# Altium project hand_logic.PrjPcb (part 2 of 3)

## Sheet USB_HUB.SchDoc
size Letter; SheetNumber: 10; SheetTotal: 15
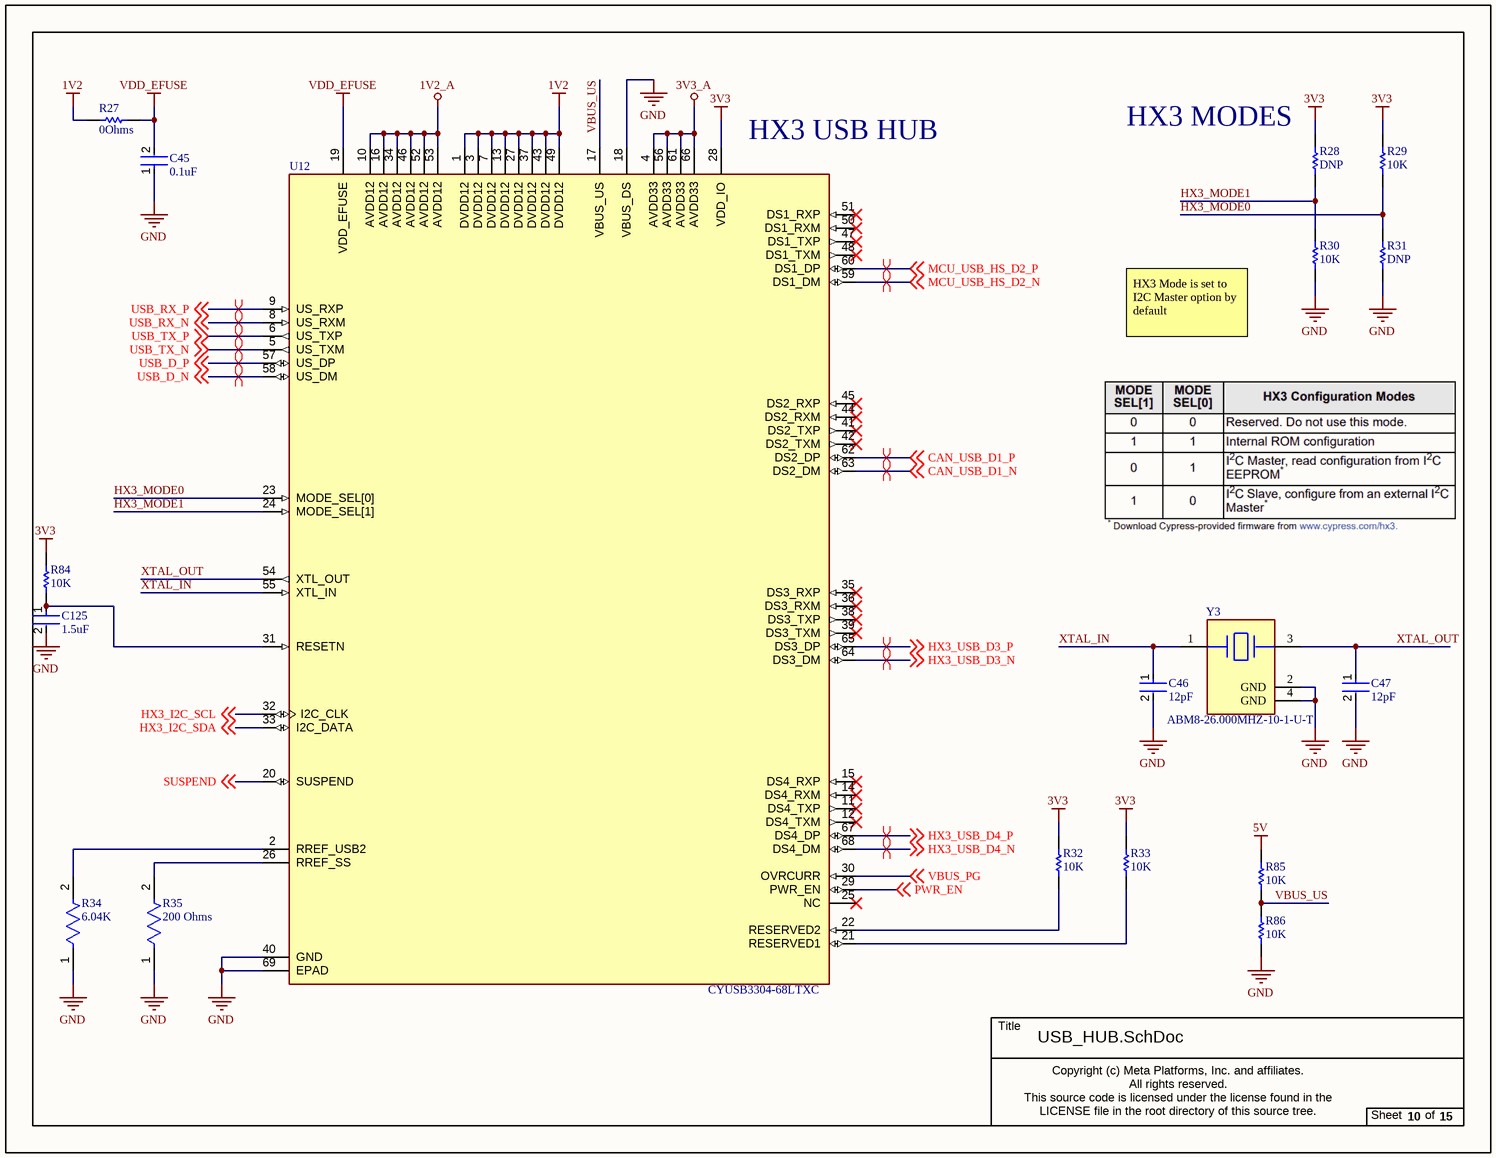
[diagram p9: USB_HUB.SchDoc]

### Parts
C45  0.1uF  [FP-CC0201-BA-MFG]
C46  12pF  [FP-0402-L_1_0_1-W_0_5_0_1-IPC_B]
C47  12pF  [FP-0402-L_1_0_1-W_0_5_0_1-IPC_B]
C125  1.5uF  [FP-C1005-050-0_05-IPC_A]
R27  0Ohms  [RESC1005X40X25ML05T10]
R28  DNP  [RESC1005X40X25ML05T10]
R29  10K  [RESC1005X40X25ML05T10]
R30  10K  [RESC1005X40X25ML05T10]
R31  DNP  [RESC1005X40X25ML05T10]
R32  10K  [RESC1005X40X25ML05T10]
R33  10K  [RESC1005X40X25ML05T10]
R34  6.04K  [FP-RMCF0402-IPC_A]
R35  200 Ohms  [FP-RMCF0402-IPC_B]
R84  10K  [RESC1005X40X25ML05T10]
R85  10K  [RESC1005X40X25ML05T10]
R86  10K  [RESC1005X40X25ML05T10]
U12  CYUSB3304-68LTXC  [QFN40P800X800X100-69M]
Y3  ABM8-26.000MHZ-10-1-U-T  [FP-ABM8-MFG]

### Nets
1V2: R27.2 U12.1(DVDD12) U12.3(DVDD12) U12.7(DVDD12) U12.13(DVDD12) U12.27(DVDD12) U12.37(DVDD12) U12.43(DVDD12) U12.49(DVDD12)
1V2_A: U12.10(AVDD12) U12.16(AVDD12) U12.34(AVDD12) U12.46(AVDD12) U12.52(AVDD12) U12.53(AVDD12)
3V3: R28.2 R29.2 R32.2 R33.2 R84.2 U12.28(VDD_IO)
3V3_A: U12.4(AVDD33) U12.56(AVDD33) U12.61(AVDD33) U12.66(AVDD33)
5V: R85.2
GND: C45.1 C46.2 C47.2 C125.2 R30.1 R31.1 R34.1 R35.1 R86.1 U12.18(VBUS_DS) U12.40(GND) U12.69(EPAD) Y3.2(GND) Y3.4(GND)
VDD_EFUSE: C45.2 R27.1 U12.19(VDD_EFUSE)
CAN_USB_D1_N: U12.63(DS2_DM) ; off-sheet CAN_USB_D1_N
CAN_USB_D1_P: U12.62(DS2_DP) ; off-sheet CAN_USB_D1_P
HX3_I2C_SCL: U12.32(I2C_CLK) ; off-sheet HX3_I2C_SCL
HX3_I2C_SDA: U12.33(I2C_DATA) ; off-sheet HX3_I2C_SDA
HX3_MODE0: R29.1 R31.2 U12.23(MODE_SEL[0])
HX3_MODE1: R28.1 R30.2 U12.24(MODE_SEL[1])
HX3_USB_D3_N: U12.64(DS3_DM) ; off-sheet HX3_USB_D3_N
HX3_USB_D3_P: U12.65(DS3_DP) ; off-sheet HX3_USB_D3_P
HX3_USB_D4_N: U12.68(DS4_DM) ; off-sheet HX3_USB_D4_N
HX3_USB_D4_P: U12.67(DS4_DP) ; off-sheet HX3_USB_D4_P
MCU_USB_HS_D2_N: U12.59(DS1_DM) ; off-sheet MCU_USB_HS_D2_N
MCU_USB_HS_D2_P: U12.60(DS1_DP) ; off-sheet MCU_USB_HS_D2_P
PWR_EN: U12.29(PWR_EN) ; off-sheet PWR_EN
SUSPEND: U12.20(SUSPEND) ; off-sheet SUSPEND
USB_D_N: U12.58(US_DM) ; off-sheet USB_D_N
USB_D_P: U12.57(US_DP) ; off-sheet USB_D_P
USB_RX_N: U12.8(US_RXM) ; off-sheet USB_RX_N
USB_RX_P: U12.9(US_RXP) ; off-sheet USB_RX_P
USB_TX_N: U12.5(US_TXM) ; off-sheet USB_TX_N
USB_TX_P: U12.6(US_TXP) ; off-sheet USB_TX_P
VBUS_PG: U12.30(OVRCURR) ; off-sheet VBUS_PG
VBUS_US: R85.1 R86.2 U12.17(VBUS_US)
XTAL_IN: C46.1 U12.55(XTL_IN) Y3.1
XTAL_OUT: C47.1 U12.54(XTL_OUT) Y3.3
NetC125_1: C125.1 R84.1 U12.31(RESETN)
NetR32_1: R32.1 U12.22(RESERVED2)
NetR33_1: R33.1 U12.21(RESERVED1)
NetR34_2: R34.2 U12.2(RREF_USB2)
NetR35_2: R35.2 U12.26(RREF_SS)

Not connected (* = marked no-connect by the designer): U12 11(DS4_TXP)* 12(DS4_TXM)* 14(DS4_RXM)* 15(DS4_RXP)* 25(NC)* 35(DS3_RXP)* 36(DS3_RXM)* 38(DS3_TXP)* 39(DS3_TXM)* 41(DS2_TXP)* 42(DS2_TXM)* 44(DS2_RXM)* 45(DS2_RXP)* 47(DS1_TXP)* 48(DS1_TXM)* 50(DS1_RXM)* 51(DS1_RXP)*

### Layout directives
differential pair; differential pair class USB_3: USB_RX_N, USB_RX_P, USB_TX_N, USB_TX_P
differential pair; differential pair class USB_2: CAN_USB_D1_N, CAN_USB_D1_P, HX3_USB_D3_N, HX3_USB_D3_P, HX3_USB_D4_N, HX3_USB_D4_P, MCU_USB_HS_D2_N, MCU_USB_HS_D2_P, USB_D_N, USB_D_P

### Notes on the sheet
- (near U12) HX3 USB HUB
- HX3 MODES
- HX3 Mode is set to
  I2C Master option by
  default
- Title
- Copyright (c) Meta Platforms, Inc. and affiliates.
  All rights reserved.
  This source code is licensed under the license found in the
  LICENSE file in the root directory of this source tree.
- Sheet
- of

### Library data of the parts
C45 = CMP-03422-000376-1: CAP CER 0.1UF 6.3V X5R 0201; Manufacturer: Yageo; Manufacturer Part Number: CC0201KRX5R5BB104; Tolerance: 0.1; Temperature Coefficient: 15%; Value: 100 nF; Material: Ceramic; Automotive: No; Device Class L2: Capacitors; Temperature Range High: +85°C; Capacitance: 100 nF; Temperature: -55°C to +85°C; ComponentLink2URL: http://www.yageo.com/documents/recent/UPY-GPHC_X5R_4V-to-50V_25.pdf; Category: Cap; Mouser Description: Multilayer Ceramic Capacitors MLCC - SMD/SMT 100nF 6.3V X5R 10%; Ipc Land Pattern Name: CAPC6030X30; Temperature Characteristic: X5R; Voltage Rating: 6.3 V; Lead Free: Yes; Digikey Description: CAP CER 0.1UF 6.3V X5R 0201; Device Class L1: Passive Components; Octopart: https://octopart.com/cc0201krx5r5bb104-yageo-9292636; Height: 0.33mm; Package: CC0201-BA; Footprint Url: http://www.yageo.com/exep/pages/download/literatures/UPY-C_GEN_24.pdf; ComponentLink2Description: Datasheet; Device Class L3: Ceramic Capacitors; Temperature Range Low: -55°C; RoHS: TRUE
C46 C47 = CMP-2008-02574-2: General Purpose Ceramic Capacitor, 0402, 12pF, 5%, C0G, 30ppm/°C, 50V; Insulation Resistance: 100GR; Radiation Hardening: No; RoHS Compliant: Yes; Voltage Rating: 50V; Case Code (Imperial): 0402; Height: 0.5mm; Voltage: 50V; Voltage Rating (DC): 50V; Mount: Surface Mount; Capacitance: 12pF; Thickness: 0.022inch; Depth: 0.5mm; Max Operating Temperature: 125°C; Construction: Flat; Termination: SMD/SMT; Tolerance: 5%; Length: 1mm; Lead Free: Lead Free; Dielectric: C0G; Number of Pins: 2; Package Quantity: 1; Series: -; Temperature Coefficient: 30ppm/°C; Min Operating Temperature: -55°C; Case/Package: 0402; Packaging: Tape and Reel; Case Code (Metric): 1005; Width: 0.02inch; REACH SVHC: No SVHC
C125 = CMP-08246-006235-1: Multilayer Ceramic Capacitors 1.5μF ±10% 10V X5R SMD 0402; Series: C; Dielectric Material: Ceramic; Tolerance: 10%; RoHS Compliant: Yes; Dielectric: X5R; Packaging: Tape and Reel; Case/Package: 0402; Voltage Rating: 10V; Thickness: 0.022inch; Construction: Flat; Height: 0.5mm; Resistor Type: Ceramic; REACH SVHC: No SVHC; Depth: 0.5mm; Voltage Rating (DC): 10V; Max Operating Temperature: 85°C; Capacitance: 1.5uF; Case Code (Metric): 1005; Number of Pins: 2; Radiation Hardening: No; Width: 0.02inch; Mount: Surface Mount; Weight: 2.3E-05oz; Min Operating Temperature: -55°C; Case Code (Imperial): 0402; Package Quantity: 1; Length: 1mm; Termination: SMD/SMT; Lead Free: Lead Free
R27-R33 R84-R86 = CMP-2002-03043-1: Part Number: CRCW040210K0FKEDHP; Manufacturer: Vishay Dale
R34 = CMP-26527-002652-1: 6.04kΩ ±1% 0.063W 0402 Thick Film Chip Resistor AEC-Q200 compliant; Temperature Coefficient: 100ppm/°C; Resistance: 6.04kR; Max Power Dissipation: 63mW; RoHS Compliant: Yes; Radiation Hardening: No; Tolerance: 1%; Series: RMCF; Resistor Type: Thick Film; Contact Plating: Tin; Case/Package: 0402; Case Code (Metric): 1005; Length: 0.039inch; Height: 0.016inch; Min Operating Temperature: -55°C; Case Code (Imperial): 0402; Width: 0.02inch; Packaging: Tape and Reel; Features: Automotive AEC-Q200; Max Operating Temperature: 155°C; Number of Terminations: 2; Mount: Surface Mount
R35 = CMP-26527-000117-1: 200Ω ±1% 0.063W 0402 Thick Film Chip Resistor AEC-Q200 compliant; Resistance: 200R; Max Power Dissipation: 63mW; Temperature Coefficient: 100ppm/°C; Number of Terminations: 2; RoHS Compliant: Yes; Mount: Surface Mount; Case Code (Imperial): 0402; Resistor Type: Thick Film; Min Operating Temperature: -55°C; Tolerance: 1%; Case/Package: 0402; Radiation Hardening: No; Contact Plating: Tin; Max Operating Temperature: 155°C; Packaging: Tape and Reel; Case Code (Metric): 1005; Features: Automotive AEC-Q200; Series: RMCF; Height: 0.016inch; Width: 0.02inch; Length: 0.039inch
U12 = CYUSB3304-68LTXC: IC USB 3.0 HUB 4-PORT 68QFN; Manufacturer: Cypress Semiconductor; Part Number: CYUSB3304-68LTXC
Y3 = CMP-27762-002739-1: Crystal 26MHz ±10ppm 10pF SMD-4 3.2mm x 2.5mm; ESR (Equivalent Series Resistance): 50R; Width: 2.5mm; Min Operating Temperature: -10°C; Max Operating Temperature: 60°C; Packaging: Tape and Reel; Resistor Type: Ceramic; Frequency Tolerance: 10ppm; Package Quantity: 1000; Case/Package: CSMD; Depth: 2.5mm; REACH SVHC: No SVHC; Load Capacitance: 10pF; Lead Free: Lead Free; Mount: Surface Mount; Termination: SMD/SMT; Number of Pins: 4; Series Resistance: 50R; Operating Frequency: 26 MHz; Tolerance: 10ppm; Frequency Stability: 10ppm; Frequency: 26MHz; Series: ABM8; Height: 0.031inch; Length: 3.2mm

## Sheet USB_HUB_SUPPORT.SchDoc
size Letter; SheetNumber: 11; SheetTotal: 15
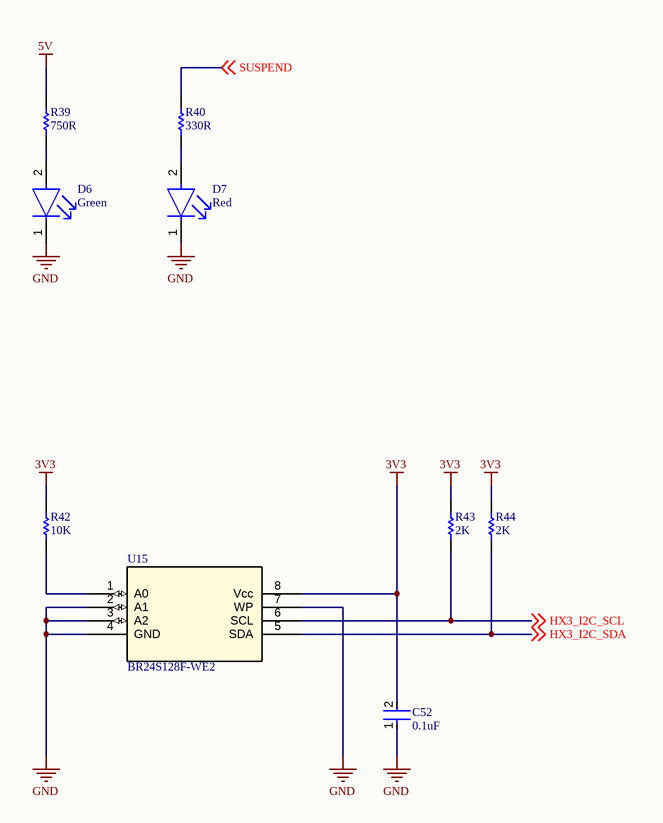
[diagram p10: USB_HUB_SUPPORT.SchDoc]

### Parts
C52  0.1uF  [FP-CC0201-BA-MFG]
D6  Green  [FP-LTST-C190KGKT-MFG]
D7  Red  [FP-LTST-C190KRKT-MFG]
R39  750R  [RESC1005X40X25ML05T05]
R40  330R  [RESC1005X40X25ML05T05]
R42  10K  [RESC1005X40X25ML05T10]
R43  2K  [RESC1005X40X20LL05T10]
R44  2K  [RESC1005X40X20LL05T10]
U15  BR24S128F-WE2  [SOP8_ROM]

### Nets
3V3: C52.2 R42.2 R43.2 R44.2 U15.8(Vcc)
5V: R39.2
GND: C52.1 D6.1(C) D7.1(C) U15.2(A1) U15.3(A2) U15.4(GND) U15.7(WP)
HX3_I2C_SCL: R43.1 U15.6(SCL) ; off-sheet HX3_I2C_SCL
HX3_I2C_SDA: R44.1 U15.5(SDA) ; off-sheet HX3_I2C_SDA
SUSPEND: R40.2 ; off-sheet SUSPEND
NetD6_2: D6.2(A) R39.1
NetD7_2: D7.2(A) R40.1
NetR42_1: R42.1 U15.1(A0)

### Notes on the sheet
- Title
- Copyright (c) Meta Platforms, Inc. and affiliates.
  All rights reserved.
  This source code is licensed under the license found in the
  LICENSE file in the root directory of this source tree.
- Sheet
- of

### Library data of the parts
C52 = CMP-03422-000376-1: as C45 on sheet USB_HUB; Automotive: No; Device Class L2: Capacitors; Temperature Range High: +85°C; Capacitance: 100 nF; Temperature: -55°C to +85°C; ComponentLink2URL: http://www.yageo.com/documents/recent/UPY-GPHC_X5R_4V-to-50V_25.pdf; Category: Cap; Mouser Description: Multilayer Ceramic Capacitors MLCC - SMD/SMT 100nF 6.3V X5R 10%; Ipc Land Pattern Name: CAPC6030X30; Temperature Characteristic: X5R; Voltage Rating: 6.3 V; Lead Free: Yes; Digikey Description: CAP CER 0.1UF 6.3V X5R 0201; Device Class L1: Passive Components; Octopart: https://octopart.com/cc0201krx5r5bb104-yageo-9292636; Height: 0.33mm; Package: CC0201-BA; Footprint Url: http://www.yageo.com/exep/pages/download/literatures/UPY-C_GEN_24.pdf; ComponentLink2Description: Datasheet; Device Class L3: Ceramic Capacitors; Temperature Range Low: -55°C; RoHS: TRUE
D6 = CMP-2000-05197-2: LED GREEN CLEAR CHIP SMD; Test Current: 20mA; Power Rating: 75mW; Forward Voltage: 2V; Wavelength: 574nm; Number of LEDs: 1; Reverse Voltage: 5V; Dominant Wavelength: 571nm; Lens Style: Diffused; Luminous Intensity: 35mcd; Forward Current: 30mA; Viewing Angle: 130°; Lens Color: Colorless; Width: 0.8mm; Case Code (Imperial): 0603; Case Code (Metric): 1608; Number of Pins: 2; Radiation Hardening: No; Package Quantity: 1; Lead Free: Lead Free; Lens Transparency: Clear; Depth: 0.8mm; Power Dissipation: 75mW; Mount: Surface Mount; Max Operating Temperature: 85°C; Case/Package: 0603; Height: 0.8mm; Illumination Color: Green; Color: Green; Length: 1.6mm; Packaging: Tape and Reel; Number of Elements: 1; Min Operating Temperature: -55°C
D7 = CMP-1674-00011-2: LED RED CLEAR CHIP SMD; Reverse Voltage: 5V; Viewing Angle: 130°; Power Rating: 75mW; Test Current: 20mA; Number of Elements: 1; Lens Color: Colorless; Wavelength: 639nm; Dominant Wavelength: 631nm; Lens Style: Diffused; Forward Current: 30mA; Forward Voltage: 2.4V; Luminous Intensity: 54mcd; Color: Red; Case Code (Imperial): 0603; Lens Transparency: Clear; Lead Free: Lead Free; Package Quantity: 1; Packaging: Tape and Reel; Max Operating Temperature: 85°C; Number of Pins: 2; Height: 0.8mm; Case/Package: 0603; Number of LEDs: 1; Width: 0.8mm; Case Code (Metric): 1608; Depth: 0.8mm; Mount: Surface Mount; Radiation Hardening: No; Length: 1.6mm; Illumination Color: Red; Power Dissipation: 75mW; Min Operating Temperature: -55°C
R39 = CMP-2002-01057-1: Part Number: ERJ-2RKF7500X; Manufacturer: Panasonic
R40 = CMP-2002-01143-1: Manufacturer: Panasonic; Part Number: ERJ2RKF3300X
R42 = CMP-2002-03043-1: as R27 on sheet USB_HUB
R43 R44 = CMP-2002-01687-1: Part Number: TNPW04022K00BEED; Manufacturer: Vishay Dale
U15 = BR24S128F-WE2: No Description Available; Mfr_Name: ROHM Semiconductor; Copyright: Copyright (C) 2022 Ultra Librarian. All rights reserved.; Manufacturer_Part_Number: BR24S128F-WE2; Digi-Key_Part_Number_1: BR24S128F-WE2TR-ND; Digi-Key_Part_Number_2: BR24S128F-WE2CT-ND; Digi-Key_Part_Number_3: BR24S128F-WE2DKR-ND; RefDes: RefDes; Type: DEV

## Sheet USB_POWER.SchDoc
size Letter; SheetNumber: 12; SheetTotal: 15
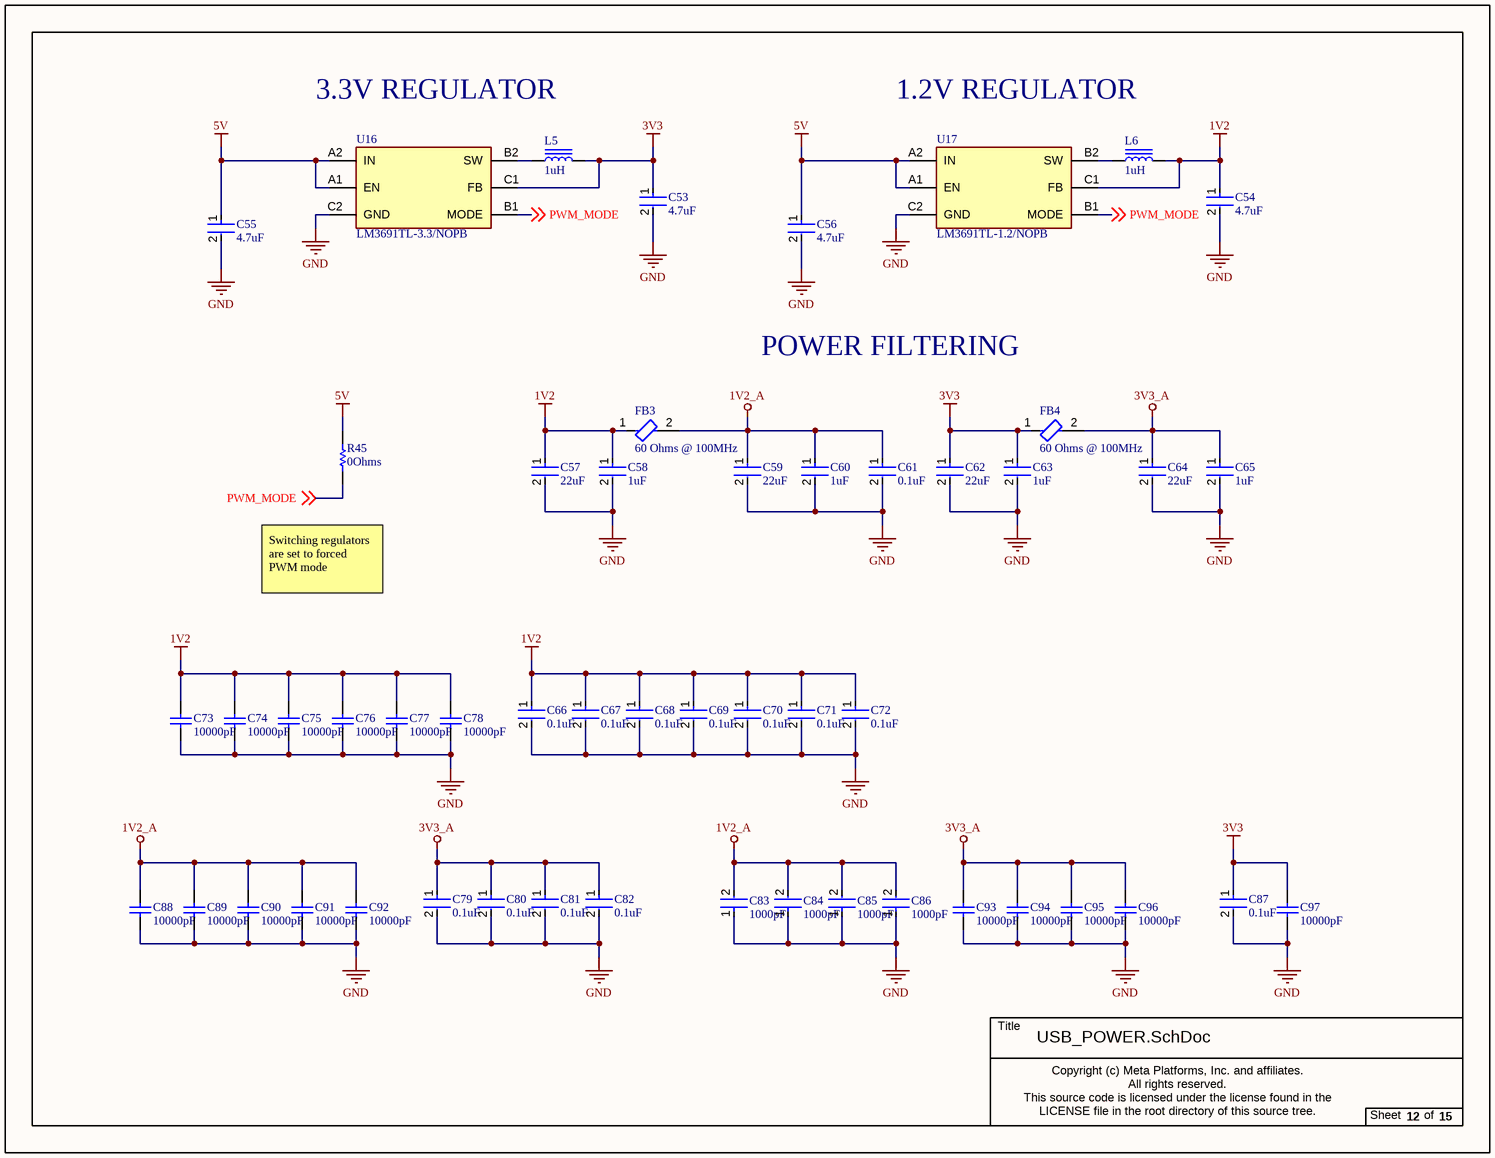
[diagram p11: USB_POWER.SchDoc]

### Parts
C53  4.7uF  [FP-CL828-IPC_C]
C54  4.7uF  [FP-CL828-IPC_C]
C55  4.7uF  [FP-CL828-IPC_C]
C56  4.7uF  [FP-CL828-IPC_C]
C57  22uF  [FP-CL05A226MQ5N6J8-IPC_C]
C58  1uF  [FP-CL511-IPC_C]
C59  22uF  [FP-CL05A226MQ5N6J8-IPC_C]
C60  1uF  [FP-CL511-IPC_C]
C61  0.1uF  [FP-CC0201-BA-MFG]
C62  22uF  [FP-CL05A226MQ5N6J8-IPC_C]
C63  1uF  [FP-CL511-IPC_C]
C64  22uF  [FP-CL05A226MQ5N6J8-IPC_C]
C65  1uF  [FP-CL511-IPC_C]
C66  0.1uF  [FP-CC0201-BA-MFG]
C67  0.1uF  [FP-CC0201-BA-MFG]
C68  0.1uF  [FP-CC0201-BA-MFG]
C69  0.1uF  [FP-CC0201-BA-MFG]
C70  0.1uF  [FP-CC0201-BA-MFG]
C71  0.1uF  [FP-CC0201-BA-MFG]
C72  0.1uF  [FP-CC0201-BA-MFG]
C73  10000pF  [CAPC1005X55X25LL05T10]
C74  10000pF  [CAPC1005X55X25LL05T10]
C75  10000pF  [CAPC1005X55X25LL05T10]
C76  10000pF  [CAPC1005X55X25LL05T10]
C77  10000pF  [CAPC1005X55X25LL05T10]
C78  10000pF  [CAPC1005X55X25LL05T10]
C79  0.1uF  [FP-CC0201-BA-MFG]
C80  0.1uF  [FP-CC0201-BA-MFG]
C81  0.1uF  [FP-CC0201-BA-MFG]
C82  0.1uF  [FP-CC0201-BA-MFG]
C83  1000pF  [FP-C0402-BB-MFG]
C84  1000pF  [FP-C0402-BB-MFG]
C85  1000pF  [FP-C0402-BB-MFG]
C86  1000pF  [FP-C0402-BB-MFG]
C87  0.1uF  [FP-CC0201-BA-MFG]
C88  10000pF  [CAPC1005X55X25LL05T10]
C89  10000pF  [CAPC1005X55X25LL05T10]
C90  10000pF  [CAPC1005X55X25LL05T10]
C91  10000pF  [CAPC1005X55X25LL05T10]
C92  10000pF  [CAPC1005X55X25LL05T10]
C93  10000pF  [CAPC1005X55X25LL05T10]
C94  10000pF  [CAPC1005X55X25LL05T10]
C95  10000pF  [CAPC1005X55X25LL05T10]
C96  10000pF  [CAPC1005X55X25LL05T10]
C97  10000pF  [CAPC1005X55X25LL05T10]
FB3  60 Ohms @ 100MHz  [FP-BLM15-0_05-d0_7-IPC_B]
FB4  60 Ohms @ 100MHz  [FP-BLM15-0_05-d0_7-IPC_B]
L5  1uH  [IND 0603_1608 RF WW]
L6  1uH  [IND 0603_1608 RF WW]
R45  0Ohms  [RESC1005X40X25ML05T10]
U16  LM3691TL-3.3/NOPB  [YZR0006APAF]
U17  LM3691TL-1.2/NOPB  [YZR0006APAF]

### Nets
1V2: C54.1 C57.1 C58.1 C66.1 C67.1 C68.1 C69.1 C70.1 C71.1 C72.1 C73.2 C74.2 C75.2 C76.2 C77.2 C78.2 FB3.1 L6.2 U17.C1(FB)
1V2_A: C59.1 C60.1 C61.1 C83.2 C84.2 C85.2 C86.2 C88.2 C89.2 C90.2 C91.2 C92.2 FB3.2
3V3: C53.1 C62.1 C63.1 C87.1 C97.2 FB4.1 L5.2 U16.C1(FB)
3V3_A: C64.1 C65.1 C79.1 C80.1 C81.1 C82.1 C93.2 C94.2 C95.2 C96.2 FB4.2
5V: C55.1 C56.1 R45.1 U16.A1(EN) U16.A2(IN) U17.A1(EN) U17.A2(IN)
GND: C53.2 C54.2 C55.2 C56.2 C57.2 C58.2 C59.2 C60.2 C61.2 C62.2 C63.2 C64.2 C65.2 C66.2 C67.2 C68.2 C69.2 C70.2 C71.2 C72.2 C73.1 C74.1 C75.1 C76.1 C77.1 C78.1 C79.2 C80.2 C81.2 C82.2 C83.1 C84.1 C85.1 C86.1 C87.2 C88.1 C89.1 C90.1 C91.1 C92.1 C93.1 C94.1 C95.1 C96.1 C97.1 U16.C2(GND) U17.C2(GND)
PWM_MODE: R45.2 U16.B1(MODE) U17.B1(MODE) ; off-sheet PWM_MODE
NetL5_1: L5.1 U16.B2(SW)
NetL6_1: L6.1 U17.B2(SW)

### Notes on the sheet
- 3.3V REGULATOR
- 1.2V REGULATOR
- POWER FILTERING
- Switching regulators
  are set to forced PWM mode
- Title
- Copyright (c) Meta Platforms, Inc. and affiliates.
  All rights reserved.
  This source code is licensed under the license found in the
  LICENSE file in the root directory of this source tree.
- Sheet
- of

### Library data of the parts
C53-C56 = CMP-13271-001251-1: Cap Ceramic 4.7uF 10V X5R ±10% SMD 0402 +85°C Paper T/R; Height: 0.5mm; Mount: Surface Mount; Case Code (Metric): 1005; Case/Package: 0402; Capacitance: 4.7uF; Packaging: Tape and Reel; Dielectric: X5R; Radiation Hardening: No; Material: Ceramic; Thickness: 0.022inch; Min Operating Temperature: -55°C; Voltage Rating: 10V; Case Code (Imperial): 0402; Width: 0.02inch; Length: 1mm; Max Operating Temperature: 85°C; Lead Free: Lead Free; Tolerance: 10%; Package Quantity: 1; Depth: 0.5mm
C57 C59 C62 C64 = CMP-13271-000001-1: CAP CER 22UF 6.3V X5R 0402; Manufacturer Part Number: CL05A226MQ5N6J8; Manufacturer: Samsung Electro-Mechanics; Material: Ceramic; Temperature Coefficient: 15%; Tolerance: 20%; Ipc Land Pattern Name: CAPC10050X50; Lead Free: Yes; Temperature Characteristic: X5R; Temperature: -55°C to +85°C; RoHS: TRUE; ComponentLink2Description: Datasheet; Device Class L3: Ceramic Capacitors; Device Class L1: Passive Components; Value: 22uF; Temperature Range High: +85°C; Automotive: No; Voltage Rating: 6.3V; Package: 0402; Category: Cap; Device Class L2: Capacitors; Height: 0.55mm; ComponentLink2URL: http://www.samsungsem.com/kr/support/library/product-catalog/__icsFiles/afieldfile/2018/11/28/MLCC.pdf; Temperature Range Low: -55°C; Octopart: https://octopart.com/cl05a226mq5n6j8-samsung-82337113; Capacitance: 22uF; Digikey Description: CAP CER 22UF 6.3V X5R 0402
C58 C60 C63 C65 = CMP-13271-001936-1: Cap Ceramic 1uF 10V X5R ±10% SMD 0402 +85°C Paper T/R; Depth: 0.5mm; Case Code (Imperial): 0402; Material: Ceramic; Mount: Surface Mount; Thickness: 0.022inch; Dielectric: X5R; Capacitance: 1uF; Radiation Hardening: No; Case/Package: 0402; Length: 1mm; Tolerance: 10%; Max Operating Temperature: 85°C; Package Quantity: 1; Width: 0.02inch; Voltage Rating: 10V; Contact Plating: Tin; Height: 0.5mm; Min Operating Temperature: -55°C; Case Code (Metric): 1005; Packaging: Tape and Reel
C61 C66-C72 C79-C82 C87 = CMP-03422-000376-1: as C45 on sheet USB_HUB; Automotive: No; Device Class L2: Capacitors; Temperature Range High: +85°C; Capacitance: 100 nF; Temperature: -55°C to +85°C; ComponentLink2URL: http://www.yageo.com/documents/recent/UPY-GPHC_X5R_4V-to-50V_25.pdf; Category: Cap; Mouser Description: Multilayer Ceramic Capacitors MLCC - SMD/SMT 100nF 6.3V X5R 10%; Ipc Land Pattern Name: CAPC6030X30; Temperature Characteristic: X5R; Voltage Rating: 6.3 V; Lead Free: Yes; Digikey Description: CAP CER 0.1UF 6.3V X5R 0201; Device Class L1: Passive Components; Octopart: https://octopart.com/cc0201krx5r5bb104-yageo-9292636; Height: 0.33mm; Package: CC0201-BA; Footprint Url: http://www.yageo.com/exep/pages/download/literatures/UPY-C_GEN_24.pdf; ComponentLink2Description: Datasheet; Device Class L3: Ceramic Capacitors; Temperature Range Low: -55°C; RoHS: TRUE
C73-C78 C88-C97 = CMP-1034-01880-2: Manufacturer: Murata; Part Number: GRM155R71E103KA01D
C83-C86 = CMP-2008-03060-3: Cap Ceramic 0.001uF 50V X7R 10% SMD 0402 125°C Paper T/R (Alt: C0402C102K5RACTU); Manufacturer: Kemet; Capacitance: 1,000 pF; Value: 1,000 pF; Tolerance: 0.1; Temperature Coefficient: 15%; Height: 0.55mm; ComponentLink2URL: https://content.kemet.com/datasheets/KEM_C1002_X7R_SMD.pdf; Temperature Range High: +125°C; Package: C0402-BB; Device Class L3: Ceramic Capacitors; Temperature Characteristic: X7R; Mouser Description: Cap Ceramic 0.001uF 50V X7R 10% SMD 0402 125°C Paper T/R (Alt: C0402C102K5RACTU); Octopart: https://octopart.com/c0402c102k5ractu-kemet-100678; Temperature Range Low: -55°C; ComponentLink2Description: Datasheet; Material: Ceramic; RoHS: TRUE; Lead Free: Yes; Device Class L1: Passive Components; Digikey Description: Cap Ceramic 0.001uF 50V X7R 10% SMD 0402 125°C Paper T/R (Alt: C0402C102K5RACTU); Voltage Rating: 50 V; Automotive: No; Ipc Land Pattern Name: CAPC10050X50; Temperature: -55°C to +125°C; Category: Cap; Manufacturer Part Number: C0402C102K5RACTU; Device Class L2: Capacitors
FB3 FB4 = CMP-0686-00129-3: Chip Ferrite Bead, 0402, 60Ω @ 100MHz, 0.06Ω, 25%, 1.7A; Number of Circuits: 1; DC Resistance (DCR): 60mR; Material: Steel; Impedance: 60R; Test Frequency: 100MHz; Lead Free: Lead Free; Radiation Hardening: No; Min Operating Temperature: -55°C; Case Code (Metric): 1005; Series: BLM15PD; Max Current Rating: 1.7A; Length: 1mm; Tolerance: 25%; Current Rating: 1.7A; RoHS Compliant: Yes; DC Current: 1.7A; Width: 0.5mm; Core Material: Ferrite; Number of Pins: 2; Depth: 0.55mm; Case Code (Imperial): 0402; Number of Lines: 1; Package Quantity: 1; Max Operating Temperature: 125°C; Case/Package: 0402; Termination: SMD/SMT; Packaging: Tape and Reel; Height: 0.5mm; Military Standard: Not; REACH SVHC: No SVHC; Max DC Current: 1.7A; DC Resistance-Max: 60MR
L5 L6 = MCHK1608T1R0MKN: SMT Inductor; Manufacturer: Taiyo Yuden; Part Number: MCHK1608T1R0MKN; Value: 1uH
R45 = CMP-2002-03043-1: as R27 on sheet USB_HUB
U16 = LM3691TL-3.3/NOPB: Buck Switching Regulator IC Positive Fixed 3.3V 1 Output 1A 6-WFBGA, DSBGA; Manufacturer: Texas Instruments; Part Number: LM3691TL-3.3/NOPB
U17 = LM3691TL-1.2/NOPB: Buck Switching Regulator IC Positive Fixed 1.2V 1 Output 1A 6-WFBGA, DSBGA; Manufacturer: Texas Instruments; Part Number: LM3691TL-1.2/NOPB

## Sheet USD_PD.SchDoc
size Letter; SheetNumber: 13; SheetTotal: 15
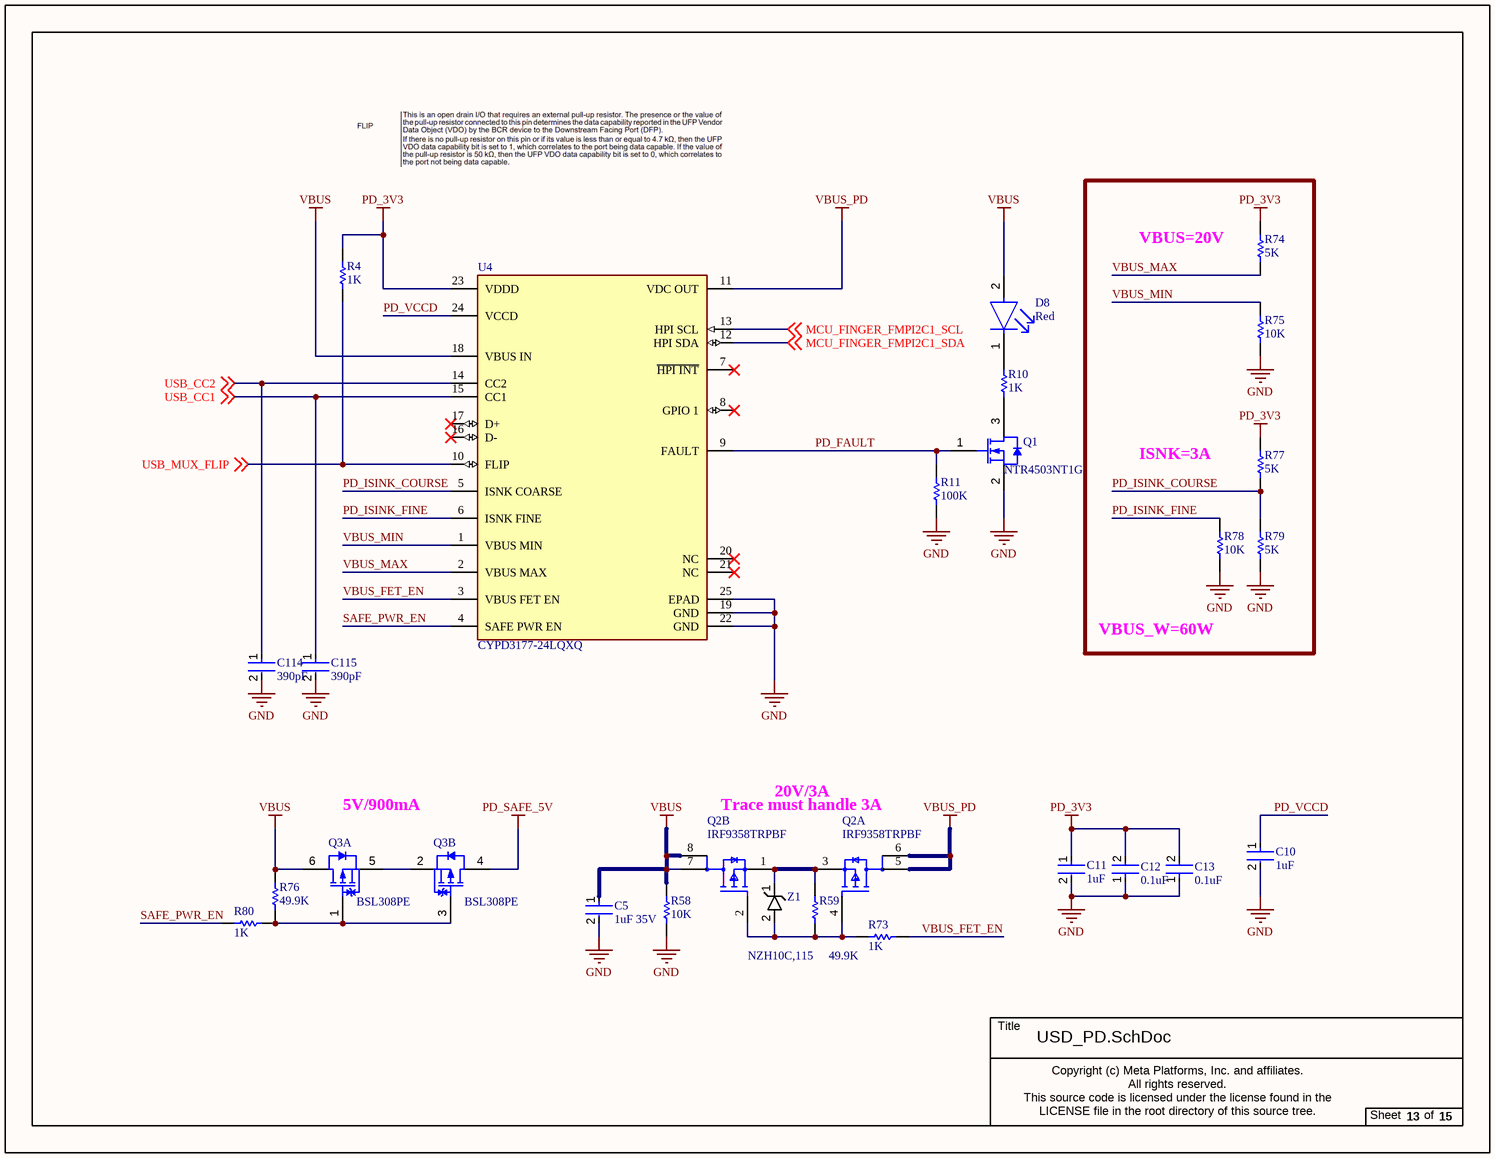
[diagram p12: USD_PD.SchDoc]

### Parts
C5  1uF 35V  [FP-C1005-050-0_05-IPC_C]
C10  1uF  [FP-CL511-IPC_C]
C11  1uF  [FP-CL511-IPC_C]
C12  0.1uF  [FP-CC0201-BA-MFG]
C13  0.1uF  [FP-CC0201-BA-MFG]
C114  390pF  [FP-C0402-BB-MFG]
C115  390pF  [FP-C0402-BB-MFG]
D8  Red  [FP-LTST-C190KRKT-MFG]
Q1  NTR4503NT1G  [ONSC-SOT-23-3-318-08_V]
Q2  IRF9358TRPBF  [FP-PG-DSO-8-IPC_A]  (parts A,B of 2)
Q3  BSL308PE  [INF-PG-TSOP-6_N]  (parts A,B of 2)
R4  1K  [RESC1005X40X25NL05T05]
R10  1K  [RESC1005X40X25NL05T05]
R11  100K  [RESC1005X40X25NL05T10]
R58  10K  [RESC1005X40X25ML05T10]
R59  49.9K  [RESC1005X35X20LL05T10]
R73  1K  [RESC1005X40X25NL05T05]
R74  5K  [RESC1005X35X20LL05T10]
R75  10K  [RESC1005X40X25ML05T10]
R76  49.9K  [RESC1005X35X20LL05T10]
R77  5K  [RESC1005X35X20LL05T10]
R78  10K  [RESC1005X40X25ML05T10]
R79  5K  [RESC1005X35X20LL05T10]
R80  1K  [RESC1005X40X25NL05T05]
U4  CYPD3177-24LQXQ  [FP-002-16934-IPC_C]
Z1  NZH10C,115  [SODFL3516X120N]

### Nets
GND: C5.2 C10.2 C11.2 C12.1 C13.1 C114.2 C115.2 Q1.2(S) R11.1 R58.1 R75.2 R78.2 R79.1 U4.19(GND) U4.22(GND) U4.25(EPAD)
PD_3V3: C11.1 C12.2 C13.2 R4.1 R74.2 R77.2 U4.23(VDDD)
PD_SAFE_5V: Q3.4(DRAIN)
VBUS: C5.1 D8.2(A) Q2.7(D2) Q2.8(D2) Q3.6(DRAIN) R58.2 R76.2 U4.18(VBUS_IN)
VBUS_PD: Q2.5(D1) Q2.6(D1) U4.11(VDC_OUT)
MCU_FINGER_FMPI2C1_SCL: U4.13(HPI_SCL) ; off-sheet MCU_FINGER_FMPI2C1_SCL
MCU_FINGER_FMPI2C1_SDA: U4.12(HPI_SDA) ; off-sheet MCU_FINGER_FMPI2C1_SDA
PD_FAULT: Q1.1(G) R11.2 U4.9(FAULT)
PD_ISINK_COURSE: R77.1 R79.2 U4.5(ISNK_COARSE)
PD_ISINK_FINE: R78.1 U4.6(ISNK_FINE)
PD_VCCD: C10.1 U4.24(VCCD)
SAFE_PWR_EN: R80.2 U4.4(SAFE_PWR_EN)
USB_CC1: C115.1 U4.15(CC1) ; off-sheet USB_CC1
USB_CC2: C114.1 U4.14(CC2) ; off-sheet USB_CC2
USB_MUX_FLIP: R4.2 U4.10(FLIP) ; off-sheet USB_MUX_FLIP
VBUS_FET_EN: R73.1 U4.3(VBUS_FET_EN)
VBUS_MAX: R74.1 U4.2(VBUS_MAX)
VBUS_MIN: R75.1 U4.1(VBUS_MIN)
NetD8_1: D8.1(C) R10.2
NetQ1_3: Q1.3(D) R10.1
NetQ2_1: Q2.1(S2) Q2.3(S1) R59.2 Z1.1(K)
NetQ2_2: Q2.2(G2) Q2.4(G1) R59.1 R73.2 Z1.2(A)
NetQ3_1: Q3.1(GATE) Q3.3(GATE) R76.1 R80.1
NetQ3_2: Q3.2(SOURCE) Q3.5(SOURCE)

Not connected (* = marked no-connect by the designer): U4 7(~{HPI_INT})* 8(GPIO_1)* 16(D-)* 17(D+)* 20(NC)* 21(NC)*

### Notes on the sheet
- (near R74) VBUS=20V
- ISNK=3A
- VBUS_W=60W
- 5V/900mA
- (near Q2) Trace must handle 3A
- 20V/3A
- Title
- Copyright (c) Meta Platforms, Inc. and affiliates.
  All rights reserved.
  This source code is licensed under the license found in the
  LICENSE file in the root directory of this source tree.
- Sheet
- of

### Library data of the parts
C5 = CMP-2000-06004-2: Multilayer Ceramic Capacitors 1μF ±10% 35V X5R SMD 0402; Series: C; Voltage Rating (DC): 35V; Capacitance: 1uF; Max Operating Temperature: 85°C; Resistor Type: Ceramic; REACH SVHC: No SVHC; Package Quantity: 1; Packaging: Tape and Reel; Termination: SMD/SMT; Dielectric Material: Ceramic; Height: 0.5mm; Length: 1mm; Min Operating Temperature: -55°C; Dielectric: X5R; Thickness: 0.022inch; Lead Free: Lead Free; Voltage Rating: 35V; Width: 0.02inch; Depth: 0.5mm; Case Code (Imperial): 0402; Case/Package: 0402; Tolerance: 10%; Weight: 2.3E-05oz; Radiation Hardening: No; RoHS Compliant: Yes; Case Code (Metric): 1005; Mount: Surface Mount
C10 C11 = CMP-13271-001936-1: as C58 on sheet USB_POWER; Depth: 0.5mm; Case Code (Imperial): 0402; Material: Ceramic; Mount: Surface Mount; Thickness: 0.022inch; Dielectric: X5R; Capacitance: 1uF; Radiation Hardening: No; Case/Package: 0402; Length: 1mm; Tolerance: 10%; Max Operating Temperature: 85°C; Package Quantity: 1; Width: 0.02inch; Voltage Rating: 10V; Contact Plating: Tin; Height: 0.5mm; Min Operating Temperature: -55°C; Case Code (Metric): 1005; Packaging: Tape and Reel
C12 C13 = CMP-03422-000376-1: as C45 on sheet USB_HUB; Automotive: No; Device Class L2: Capacitors; Temperature Range High: +85°C; Capacitance: 100 nF; Temperature: -55°C to +85°C; ComponentLink2URL: http://www.yageo.com/documents/recent/UPY-GPHC_X5R_4V-to-50V_25.pdf; Category: Cap; Mouser Description: Multilayer Ceramic Capacitors MLCC - SMD/SMT 100nF 6.3V X5R 10%; Ipc Land Pattern Name: CAPC6030X30; Temperature Characteristic: X5R; Voltage Rating: 6.3 V; Lead Free: Yes; Digikey Description: CAP CER 0.1UF 6.3V X5R 0201; Device Class L1: Passive Components; Octopart: https://octopart.com/cc0201krx5r5bb104-yageo-9292636; Height: 0.33mm; Package: CC0201-BA; Footprint Url: http://www.yageo.com/exep/pages/download/literatures/UPY-C_GEN_24.pdf; ComponentLink2Description: Datasheet; Device Class L3: Ceramic Capacitors; Temperature Range Low: -55°C; RoHS: TRUE
C114 C115 = CMP-2008-03313-2: CAP CER 390PF 50V C0G/NP0 0402; Manufacturer Part Number: C0402C391J5GACTU; Manufacturer: Kemet; Tolerance: 0.05; Temperature Coefficient: 15%; Material: Ceramic; Temperature Characteristic: C0G; Device Class L2: Capacitors; Value: 390 pF; Capacitance: 390 pF; Octopart: https://octopart.com/c0402c391j5gactu-kemet-13148117; ComponentLink2URL: https://content.kemet.com/datasheets/KEM_C1002_X7R_SMD.pdf; RoHS: TRUE; Temperature Range High: +125°C; ComponentLink2Description: Datasheet; Voltage Rating: 50 V; Ipc Land Pattern Name: CAPC10050X50; Package: C0402-BB; Lead Free: Yes; Digikey Description: CAP CER 390PF 50V C0G/NP0 0402; Category: Cap; Temperature: -55°C to +125°C; Device Class L3: Ceramic Capacitors; Device Class L1: Passive Components; Temperature Range Low: -55°C; Height: 0.55mm; Mouser Description: Multilayer Ceramic Capacitors MLCC - SMD/SMT 50volts 390pF 5% C0G; Automotive: No
D8 = CMP-1674-00011-2: as D7 on sheet USB_HUB_SUPPORT; Color: Red; Case Code (Imperial): 0603; Lens Transparency: Clear; Lead Free: Lead Free; Package Quantity: 1; Packaging: Tape and Reel; Max Operating Temperature: 85°C; Number of Pins: 2; Height: 0.8mm; Case/Package: 0603; Number of LEDs: 1; Width: 0.8mm; Case Code (Metric): 1608; Depth: 0.8mm; Mount: Surface Mount; Radiation Hardening: No; Length: 1.6mm; Illumination Color: Red; Power Dissipation: 75mW; Min Operating Temperature: -55°C
Q1 = CMP-1058-00742-1: Power MOSFET, 30 V, 2.5 A, Single N-Channel, 3-Pin SOT-23, Pb-Free, Tape and Reel; Manufacturer: On Semiconductor; Qrr Typ (nC): 4; ID Max (A): 2.5; VGS(th) Max (V): 3; VGS Max (V): 20; Channel Polarity: N Channel; V(BR)DSS Min (V): 30; ComponentLink3URL: http://www.onsemi.cn/pub_link/Collateral/318-08.PDF; PackageReference: SOT-23-3-318-08; ComponentLink2URL: http://www.onsemi.cn/pub_link/Collateral/NTR4503N-D.PDF; ComponentLink2Description: Datasheet; ComponentLink1Description: Manufacturer URL; Configuration: Single; ComponentLink1URL: http://www.onsemi.com/; PackageVersion: Rev. AP, 11/2009; Package Type: SOT-23-3; DatasheetVersion: Rev. 6; ComponentLink3Description: Package Specification; PartNumber: NTR4503NT1G; Packing: Tape and Reel; RoHS: Pb-Free; Mounting Technology: Surface Mount; PackageDescription: 3-Pin Small Outline Transistor, Body 2.92 x 1.3 mm, Pitch 0.95 mm
Q2 = CMP-32901-000912-1: MOSFET 2P-CH 30V 9.2A 8SOIC; Max Dual Supply Voltage: -30V; Max Power Dissipation: 2W; Rds On Max: 16.3mR; Threshold Voltage: -1.8V; Input Capacitance: 1.74nF; Packaging: Cut Tape; Min Operating Temperature: -55°C; Series: HEXFET®; Mount: Surface Mount; Max Operating Temperature: 150°C; Lead Free: Lead Free; Halogen Free: Halogen Free; Continuous Drain Current (ID): 9.2A; Drain to Source Voltage (Vdss): -30V; Case/Package: SO; Number of Pins: 8; RoHS Compliant: Yes
Q3 = CMP-1099-00070-1: P-Channel OptiMOS P3 Small-Signal-Transistor, -30 V VDS, -2 A ID, -55 to 150 degC, PG-TSOP-6, Reel, Green; Manufacturer: Infineon; VGS(th) (max): -1Â V; RDS (on) (max) (@4.5V): 130Â mOhm; QG: -5Â nC; VGS(th) (min): -2Â V; VDS (max): -30Â V; Green: TRUE; ID (max): -2Â A; IDpuls (max): -8Â A; Pto t (max): 0.5Â W; Rth: 250Â K/W; RDS (on) (max): 80Â mOhm; DatasheetVersion: Rev. 2.02; ComponentLink3Description: Package Specification; Packing: Reel; Mounting Technology: Surface Mount; ComponentLink1URL: http://www.infineon.com/; ComponentLink1Description: Manufacturer URL; ComponentLink2Description: Datasheet; ComponentLink2URL: http://www.infineon.com/dgdl/BSL308PE_Rev22.pdf?folderId=db3a304314dca38901154a72e3951a65&fileId=db3a30431d8a6b3c011d8ff3592c03d0; PackageReference: PG-TSOP-6; ComponentLink3URL: http://www.infineon.com/cms/packages/SMD_-_Surface_Mounted_Devices/TSOP/TSOP6.html?__locale=en; PackageDescription: 6-Pin Thin Small Outline Package, 2.9 x 1.6 mm Body, 0.95 mm Pitch; PartNumber: BSL308PE
R4 R10 R73 R80 = CMP-1011-00510-4: Chip Resistor, 1 KOhm, +/- 1%, 100 mW, -55 to 155 degC, 0402 (1005 Metric), RoHS, Tape and Reel; PartNumber: ERJ-2RKF1001X; Manufacturer: Basic Passives; Voltage Rating: 50 V; Case\/Package: 0402; Resistance: 1 KOhm; Power Rating: 100 mW; DatasheetVersion: 04/2015; Radiation Hardening: No; Pins: 2; Height: 0.35 mm; RoHSCompliant: true; Case Code (Imperial): 0402; ComponentLink2Description: Datasheet; ComponentLink1Description: Manufacturer URL; PackageReference: 0402; Mount: Surface Mount; Package Quantity: 10000; Tolerance: 1%; ComponentLink1URL: http://www.panasonic.com/; PackageDescription: 2-Pin Surface Mount Device, Body 1 x 0.5 mm; Mounting Technology: Surface Mount; Case Code (Metric): 1005; ComponentLink2URL: http://industrial.panasonic.com/cdbs/www-data/pdf/RDA0000/AOA0000C86.pdf; REACH SVHC: Yes; Packaging: Tape and Reel; Max Operating Temperature: 155 degC; Min Operating Temperature: -55 degC; Width: 0.5 mm; Length: 1 mm
R11 = CMP-2002-07343-1: Part Number: RC0402FR-07100KL; Manufacturer: Yageo / Phycomp
R58 R75 R78 = CMP-2002-03043-1: as R27 on sheet USB_HUB
R59 R76 = CMP-2002-03315-1: Part Number: CPF0402B49K9E1; Manufacturer: TE Connectivity / AMP
R74 R77 R79 = CMP-2002-03342-1: Manufacturer: TE Connectivity / AMP; Part Number: CPF0402B5K1E1
U4 = CMP-12917-000005-1: IC USB TYPE-C PORT CONTROL 24QFN
Z1 = NZH10C,115: Zener Diode; Manufacturer_Name: Nexperia; Datasheet Link: https://assets.nexperia.com/documents/data-sheet/NZH_SER.pdf; Height: 1.2mm; Manufacturer_Part_Number: NZH10C,115; Mouser Part Number: 771-NZH10C-115; Mouser Price/Stock: https://www.mouser.co.uk/ProductDetail/Nexperia/NZH10C115?qs=5DYmZrWuUEoyHVRX7wWPEg%3D%3D; Arrow Part Number: NZH10C,115; Arrow Price/Stock: https://www.arrow.com/en/products/nzh10c115/nexperia?region=nac

## Sheet USB_PD_POWER.SchDoc
size Letter; SheetNumber: 14; SheetTotal: 15
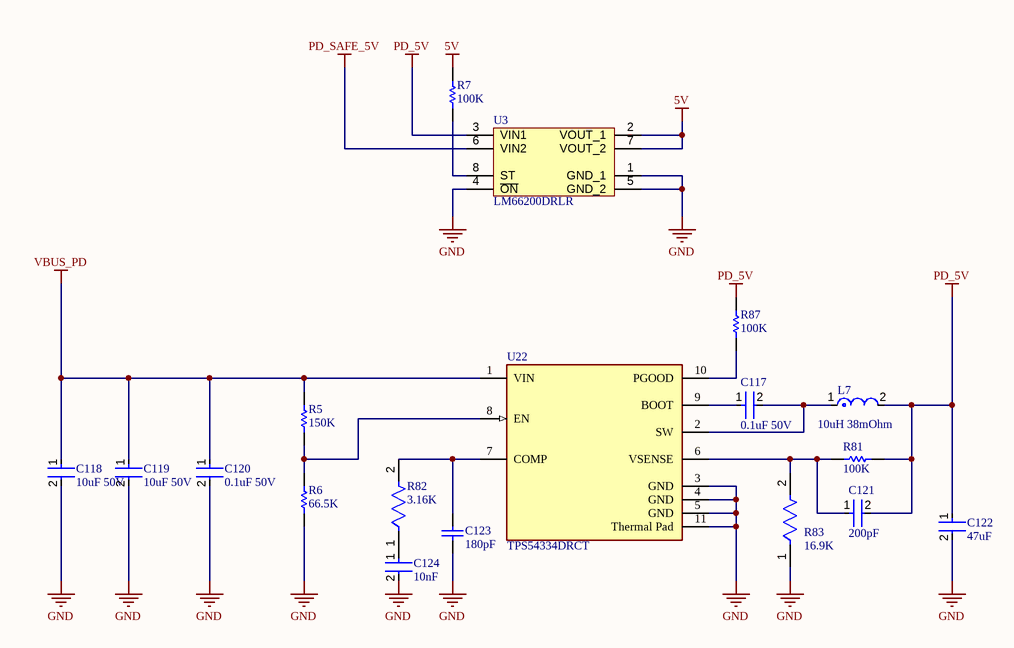
[diagram p13: USB_PD_POWER.SchDoc]

### Parts
C117  0.1uF 50V  [FP-C0805C-DN-MFG]
C118  10uF 50V  [FP-C3225-250-0_4-MFG]
C119  10uF 50V  [FP-C3225-250-0_4-MFG]
C120  0.1uF 50V  [FP-C0805C-DN-MFG]
C121  200pF  [FP-C0402-BB-MFG]
C122  47uF  [FP-C3216-160-0_2-IPC_C]
C123  180pF  [CAPC1005X55X25NL05T10]
C124  10nF  [FP-GRM155-0_05-IPC_C]
L7  10uH 38mOhm  [FP-XAL5050-MFG]
R5  150K  [RESC1005X40X25NL10T10]
R6  66.5K  [RESC1005X40X25ML05T05]
R7  100K  [RESC1005X40X25NL05T10]
R81  100K  [RESC1005X40X25NL05T10]
R82  3.16K  [FP-CRCW0402-e3-IPC_C]
R83  16.9K  [FP-CRCW0402-e3-MFG]
R87  100K  [RESC1005X40X25NL05T10]
U3  LM66200DRLR  [SOTFL50P160X60-8N]
U22  TPS54334DRCT  [FP-DRC0010J-IPC_B]

### Nets
5V: R7.1 U3.2(VOUT_1) U3.7(VOUT_2)
GND: C118.2 C119.2 C120.2 C122.2 C123.1 C124.2 R6.1 R83.1 U3.1(GND_1) U3.4(~{ON}) U3.5(GND_2) U22.3(GND) U22.4(GND) U22.5(GND) U22.11(Thermal_Pad)
PD_5V: C121.2 C122.1 L7.2 R81.1 R87.1 U3.3(VIN1)
PD_SAFE_5V: U3.6(VIN2)
VBUS_PD: C118.1 C119.1 C120.1 R5.2 U22.1(VIN)
NetC117_1: C117.1 U22.9(BOOT)
NetC117_2: C117.2 L7.1 U22.2(SW)
NetC121_1: C121.1 R81.2 R83.2 U22.6(VSENSE)
NetC123_2: C123.2 R82.2 U22.7(COMP)
NetC124_1: C124.1 R82.1
NetR5_1: R5.1 R6.2 U22.8(EN)
NetR7_2: R7.2 U3.8(ST)
NetR87_2: R87.2 U22.10(PGOOD)

### Notes on the sheet
- Title
- Copyright (c) Meta Platforms, Inc. and affiliates.
  All rights reserved.
  This source code is licensed under the license found in the
  LICENSE file in the root directory of this source tree.
- Sheet
- of

### Library data of the parts
C117 C120 = CMP-1036-04423-3: CAP CER 0.1UF 50V X7R 0805; Manufacturer Part Number: C0805C104M5RACTU; Manufacturer: KEMET; Tolerance: 0.2; Temperature Coefficient: 30ppm/°C; Material: Ceramic; Capacitance: 0.10 μF; Value: 0.10 μF; Temperature: -55°C to +125°C; RoHS: TRUE; Temperature Range Low: -55°C; Device Class L3: Ceramic Capacitors; Octopart: https://octopart.com/c0805c104m5ractu-kemet-129379; Ipc Land Pattern Name: CAPC200125X78; Mouser Description: Multilayer Ceramic Capacitors MLCC - SMD/SMT 50volts 0.1uF X7R 20%; Temperature Range High: +125°C; Package: C0805C-DN; Temperature Characteristic: X7R; Automotive: No; ComponentLink2URL: https://content.kemet.com/datasheets/KEM_C1003_C0G_SMD.pdf; Device Class L1: Passive Components; ComponentLink2Description: Datasheet; Device Class L2: Capacitors; Voltage Rating: 50 V; Digikey Description: CAP CER 0.1UF 50V X7R 0805; Lead Free: Yes; Height: 0.88mm; Category: Cap
C118 C119 = CMP-08246-002653-1: Multilayer Ceramic Capacitors 10uF ±20% 50V X7R SMD 1210; Width: 0.098inch; Package Quantity: 1000; Height: 2.5mm; Dielectric Material: Ceramic; Voltage Rating: 50V; Series: C; Capacitance: 10uF; Tolerance: 20%; Weight: 0.000564oz; Case/Package: 1210; Case Code (Imperial): 1210; Dielectric: X7R; Case Code (Metric): 3225; REACH SVHC: No SVHC; Packaging: Tape and Reel; Length: 0.126inch; Termination: SMD/SMT; Min Operating Temperature: -55°C; Voltage Rating (DC): 50V; Lead Free: Lead Free; Max Operating Temperature: 125°C; Thickness: 0.11inch; Mount: Surface Mount
C121 = CMP-1034-01347-3: CAP CER 200PF 50V NP0 0402; Manufacturer Part Number: C0402C201J5GACTU; Manufacturer: Kemet; Temperature Coefficient: 15%; Temperature Characteristic: C0G; Material: Ceramic; Tolerance: 0.05; Lead Free: Yes; Temperature: -55°C to +125°C; Height: 0.55mm; ComponentLink2URL: https://content.kemet.com/datasheets/KEM_C1002_X7R_SMD.pdf; Temperature Range High: +125°C; RoHS: TRUE; Ipc Land Pattern Name: CAPC10050X50; Package: C0402-BB; Digikey Description: CAP CER 200PF 50V NP0 0402; Octopart: https://octopart.com/c0402c201j5gactu-kemet-19049754; Category: Cap; Value: 200 pF; Automotive: No; Capacitance: 200 pF; ComponentLink2Description: Datasheet; Device Class L3: Ceramic Capacitors; Temperature Range Low: -55°C; Device Class L1: Passive Components; Voltage Rating: 50 V; Mouser Description: Cap Ceramic 200pF 50V C0G 5% SMD 0402 125°C Punched Paper T/R; Device Class L2: Capacitors
C122 = CMP-08246-007132-1: Multilayer Ceramic Capacitors 47uF ±20% 10V X6S SMD 1206; Case Code (Metric): 3216; Min Operating Temperature: -55°C; Case Code (Imperial): 1206; Lead Free: Lead Free; Package Quantity: 1; Dielectric Material: Ceramic; Case/Package: 1206; REACH SVHC: No SVHC; Resistor Type: Ceramic; Capacitance: 47uF; Depth: 1.6mm; Mount: Surface Mount; Voltage Rating (DC): 10V; RoHS Compliant: Yes; Width: 1.6mm; Length: 3.2mm; Termination: SMD/SMT; Max Operating Temperature: 105°C; Construction: Flat; Voltage Rating: 10V; Series: C; Dielectric: X6S; Tolerance: 20%; Thickness: 0.071inch; Packaging: Tape and Reel; Height: 1.6mm; Weight: 0.000571oz
C123 = CMP-2008-04274-1: Manufacturer: Murata; Part Number: GRM1555C1H181JA01D
C124 = CMP-2008-04637-5: Chip Multilayer Ceramic Capacitors for General Purpose, 0402, 10000pF, X7R, 15%, 10%, 50V; Voltage: 25V; Tolerance: 10%; Mount: Surface Mount; Lead Free: Lead Free; Radiation Hardening: No; Case Code (Imperial): 0402; REACH SVHC: No SVHC; Case/Package: 0402; Dielectric: X7R; Voltage Rating (DC): 50V; Max Operating Temperature: 125°C; Termination: SMD/SMT; Material: Ceramic; Width: 0.02inch; Package Quantity: 1; Voltage Rating: 50V; Thickness: 0.022inch; Packaging: Tape and Reel; Height: 0.5mm; Number of Pins: 2; Case Code (Metric): 1005; Min Operating Temperature: -55°C; Length: 1mm; Capacitance: 10nF; Depth: 0.5mm
L7 = CMP-11268-000214-1: Power Inductors - SMD 8.2uH Shld 20% 6.1A 34.95mOhms AECQ2; Shielding: Shielded; Core Material: Composite; DC Resistance (DCR): 34.95mR; Saturation Current: 5.6A; Self Resonant Frequency: 18MHz; Test Frequency: 100kHz; Series: XAL5050; Width: 5.48mm; RoHS Compliant: Yes; Height: 5.1mm; Min Operating Temperature: -40°C; Length: 5.68mm; Packaging: Tape and Reel; Inductance: 8.2uH; Mount: Surface Mount; Max DC Current: 6.1A; Inductance Tolerance: 20%; Case/Package: SMD/SMT; Reach SVHC Compliant: Yes; Lead Free: Contains Lead; RMS Current (Irms): 6.1A; Termination: SMD/SMT; Tolerance: 20%; Package Quantity: 250; Max Operating Temperature: 125°C
R5 = CMP-2002-05692-1: Part Number: CRG0402F150K; Manufacturer: TE Connectivity / AMP
R6 = CMP-2002-00162-1: Part Number: CRCW040266K5FKED; Manufacturer: Vishay Dale
R7 R81 R87 = CMP-2002-07343-1: as R11 on sheet USD_PD
R82 = CMP-02407-010089-1: RES Thick Film, 3.16kΩ, 1%, 0.063W, 100ppm/°C, 0402
R83 = CMP-2002-08240-2: RES Thick Film, 16.9kΩ, 1%, 0.063W, 100ppm/°C, 0402; Resistance: 16.9kR; Voltage Rating: 50V; Max Power Dissipation: 63mW; Tolerance: 1%; Weight: 2.3E-05oz; Case/Package: 0402; Package Quantity: 10; Packaging: Tape and Reel; Case Code (Imperial): 0402; Number of Pins: 2; Height: 0.016inch; Width: 0.02inch; Number of Terminations: 2; Depth: 0.5mm; Composition: Thick Film; Features: Automotive AEC-Q200; Termination: SMD/SMT; Radiation Hardening: No; Temperature Coefficient: 100ppm/°C; Military Standard: Not; Length: 1mm; Min Operating Temperature: -55°C; Contact Plating: Tin; Max Operating Temperature: 155°C; Power Rating: 63mW; Case Code (Metric): 1005
U3 = LM66200DRLR: Integrated Circuit; Manufacturer_Name: Texas Instruments; Datasheet Link: https://www.ti.com/lit/gpn/lm66200; Height: 0.6mm; Manufacturer_Part_Number: LM66200DRLR; Mouser Part Number: 595-LM66200DRLR; Mouser Price/Stock: https://www.mouser.co.uk/ProductDetail/Texas-Instruments/LM66200DRLR?qs=Rp5uXu7WBW90hnpZAkIOdQ%3D%3D; Arrow Part Number: LM66200DRLR; Arrow Price/Stock: https://www.arrow.com/en/products/lm66200drlr/texas-instruments?region=nac
U22 = CMP-04918-000651-1: IC REG BUCK ADJUSTABLE 3A 10VSON; Number of Outputs: 1; Output Configuration: Positive; Min Input Voltage: 4.2V; Quiescent Current: 600uA; Switching Frequency: 570kHz; Output Voltage: 24V; Min Output Voltage: 800mV; Synchronous Rectifier: Yes; Max Input Voltage: 28V; Output Current: 3A; REACH SVHC: No SVHC; Output Type: Adjustable; Packaging: Tape and Reel; RoHS Compliant: Yes; Max Output Voltage: 24V; Min Operating Temperature: -40°C; Lead Free: Lead Free; Mount: Surface Mount; Max Operating Temperature: 85°C; Number of Pins: 10

## Sheet FINGER_USB_HUB.SchDoc
size Letter; SheetNumber: 15; SheetTotal: 15
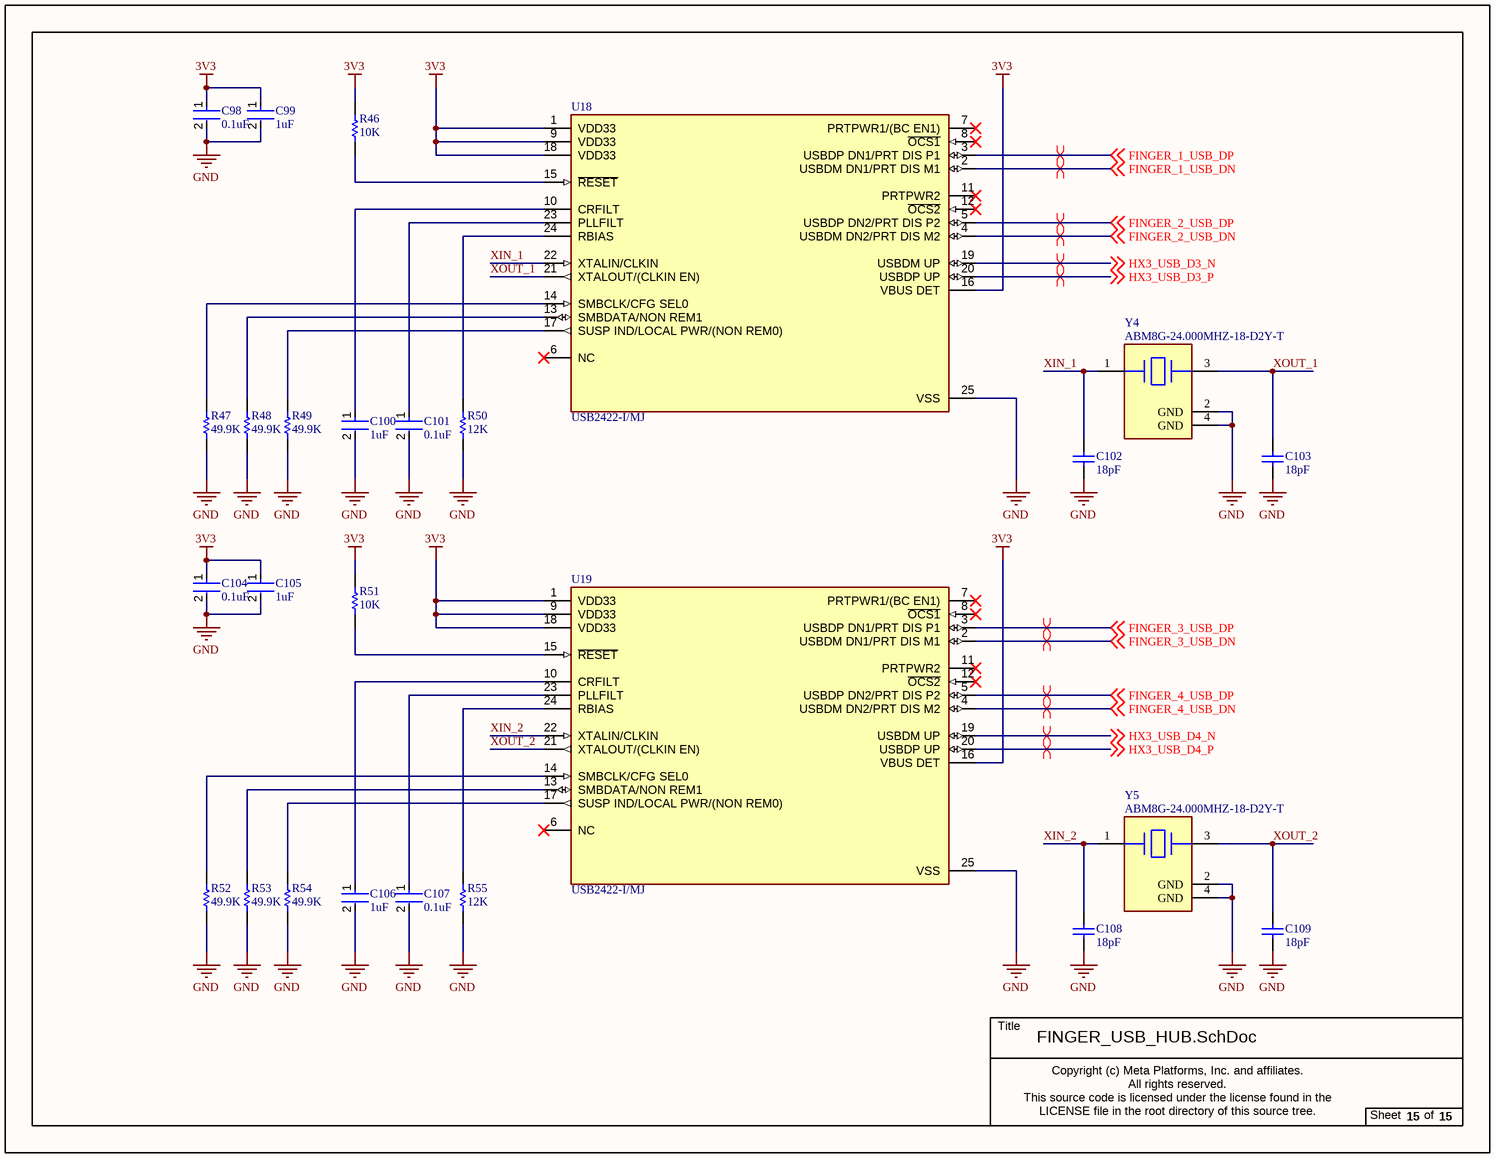
[diagram p14: FINGER_USB_HUB.SchDoc]

### Parts
C98  0.1uF  [FP-CC0201-BA-MFG]
C99  1uF  [FP-CL511-IPC_C]
C100  1uF  [FP-CL511-IPC_C]
C101  0.1uF  [FP-CC0201-BA-MFG]
C102  18pF  [CAPC1005X55X25NL05T10]
C103  18pF  [CAPC1005X55X25NL05T10]
C104  0.1uF  [FP-CC0201-BA-MFG]
C105  1uF  [FP-CL511-IPC_C]
C106  1uF  [FP-CL511-IPC_C]
C107  0.1uF  [FP-CC0201-BA-MFG]
C108  18pF  [CAPC1005X55X25NL05T10]
C109  18pF  [CAPC1005X55X25NL05T10]
R46  10K  [RESC1005X40X25ML05T10]
R47  49.9K  [RESC1005X40X25ML05T10]
R48  49.9K  [RESC1005X40X25ML05T10]
R49  49.9K  [RESC1005X40X25ML05T10]
R50  12K  [RESC1005X40X25ML05T05]
R51  10K  [RESC1005X40X25ML05T10]
R52  49.9K  [RESC1005X40X25ML05T10]
R53  49.9K  [RESC1005X40X25ML05T10]
R54  49.9K  [RESC1005X40X25ML05T10]
R55  12K  [RESC1005X40X25ML05T05]
U18  USB2422-I/MJ  [FP-24-S4QFN-4x4B-0_5P-MFG]
U19  USB2422-I/MJ  [FP-24-S4QFN-4x4B-0_5P-MFG]
Y4  ABM8G-24.000MHZ-18-D2Y-T  [FP-ABM8G-MFG]
Y5  ABM8G-24.000MHZ-18-D2Y-T  [FP-ABM8G-MFG]

### Nets
3V3: C98.1 C99.1 C104.1 C105.1 R46.2 R51.2 U18.1(VDD33) U18.9(VDD33) U18.16(VBUS_DET) U18.18(VDD33) U19.1(VDD33) U19.9(VDD33) U19.16(VBUS_DET) U19.18(VDD33)
GND: C98.2 C99.2 C100.2 C101.2 C102.1 C103.1 C104.2 C105.2 C106.2 C107.2 C108.1 C109.1 R47.1 R48.1 R49.1 R50.1 R52.1 R53.1 R54.1 R55.1 U18.25(VSS) U19.25(VSS) Y4.2(GND) Y4.4(GND) Y5.2(GND) Y5.4(GND)
FINGER_1_USB_DN: U18.2(USBDM_DN1/PRT_DIS_M1) ; off-sheet FINGER_1_USB_DN
FINGER_1_USB_DP: U18.3(USBDP_DN1/PRT_DIS_P1) ; off-sheet FINGER_1_USB_DP
FINGER_2_USB_DN: U18.4(USBDM_DN2/PRT_DIS_M2) ; off-sheet FINGER_2_USB_DN
FINGER_2_USB_DP: U18.5(USBDP_DN2/PRT_DIS_P2) ; off-sheet FINGER_2_USB_DP
FINGER_3_USB_DN: U19.2(USBDM_DN1/PRT_DIS_M1) ; off-sheet FINGER_3_USB_DN
FINGER_3_USB_DP: U19.3(USBDP_DN1/PRT_DIS_P1) ; off-sheet FINGER_3_USB_DP
FINGER_4_USB_DN: U19.4(USBDM_DN2/PRT_DIS_M2) ; off-sheet FINGER_4_USB_DN
FINGER_4_USB_DP: U19.5(USBDP_DN2/PRT_DIS_P2) ; off-sheet FINGER_4_USB_DP
HX3_USB_D3_N: U18.19(USBDM_UP) ; off-sheet HX3_USB_D3_N
HX3_USB_D3_P: U18.20(USBDP_UP) ; off-sheet HX3_USB_D3_P
HX3_USB_D4_N: U19.19(USBDM_UP) ; off-sheet HX3_USB_D4_N
HX3_USB_D4_P: U19.20(USBDP_UP) ; off-sheet HX3_USB_D4_P
XIN_1: C102.2 U18.22(XTALIN/CLKIN) Y4.1
XIN_2: C108.2 U19.22(XTALIN/CLKIN) Y5.1
XOUT_1: C103.2 U18.21(XTALOUT/(CLKIN_EN)) Y4.3
XOUT_2: C109.2 U19.21(XTALOUT/(CLKIN_EN)) Y5.3
NetC100_1: C100.1 U18.10(CRFILT)
NetC101_1: C101.1 U18.23(PLLFILT)
NetC106_1: C106.1 U19.10(CRFILT)
NetC107_1: C107.1 U19.23(PLLFILT)
NetR46_1: R46.1 U18.15(~{RESET})
NetR47_2: R47.2 U18.14(SMBCLK/CFG_SEL0)
NetR48_2: R48.2 U18.13(SMBDATA/NON_REM1)
NetR49_2: R49.2 U18.17(SUSP_IND/LOCAL_PWR/(NON_REM0))
NetR50_2: R50.2 U18.24(RBIAS)
NetR51_1: R51.1 U19.15(~{RESET})
NetR52_2: R52.2 U19.14(SMBCLK/CFG_SEL0)
NetR53_2: R53.2 U19.13(SMBDATA/NON_REM1)
NetR54_2: R54.2 U19.17(SUSP_IND/LOCAL_PWR/(NON_REM0))
NetR55_2: R55.2 U19.24(RBIAS)

Not connected (* = marked no-connect by the designer): U18 6(NC)* 7(PRTPWR1/(BC_EN1))* 8(~{OCS1})* 11(PRTPWR2)* 12(~{OCS2})*; U19 6(NC)* 7(PRTPWR1/(BC_EN1))* 8(~{OCS1})* 11(PRTPWR2)* 12(~{OCS2})*

### Layout directives
differential pair; differential pair class USB_2: FINGER_1_USB_DN, FINGER_1_USB_DP, FINGER_2_USB_DN, FINGER_2_USB_DP, FINGER_3_USB_DN, FINGER_3_USB_DP, FINGER_4_USB_DN, FINGER_4_USB_DP, HX3_USB_D3_N, HX3_USB_D3_P, HX3_USB_D4_N, HX3_USB_D4_P

### Notes on the sheet
- Title
- Copyright (c) Meta Platforms, Inc. and affiliates.
  All rights reserved.
  This source code is licensed under the license found in the
  LICENSE file in the root directory of this source tree.
- Sheet
- of

### Library data of the parts
C98 C101 C104 C107 = CMP-03422-000376-1: as C45 on sheet USB_HUB; Automotive: No; Device Class L2: Capacitors; Temperature Range High: +85°C; Capacitance: 100 nF; Temperature: -55°C to +85°C; ComponentLink2URL: http://www.yageo.com/documents/recent/UPY-GPHC_X5R_4V-to-50V_25.pdf; Category: Cap; Mouser Description: Multilayer Ceramic Capacitors MLCC - SMD/SMT 100nF 6.3V X5R 10%; Ipc Land Pattern Name: CAPC6030X30; Temperature Characteristic: X5R; Voltage Rating: 6.3 V; Lead Free: Yes; Digikey Description: CAP CER 0.1UF 6.3V X5R 0201; Device Class L1: Passive Components; Octopart: https://octopart.com/cc0201krx5r5bb104-yageo-9292636; Height: 0.33mm; Package: CC0201-BA; Footprint Url: http://www.yageo.com/exep/pages/download/literatures/UPY-C_GEN_24.pdf; ComponentLink2Description: Datasheet; Device Class L3: Ceramic Capacitors; Temperature Range Low: -55°C; RoHS: TRUE
C99 C100 C105 C106 = CMP-13271-001936-1: as C58 on sheet USB_POWER; Depth: 0.5mm; Case Code (Imperial): 0402; Material: Ceramic; Mount: Surface Mount; Thickness: 0.022inch; Dielectric: X5R; Capacitance: 1uF; Radiation Hardening: No; Case/Package: 0402; Length: 1mm; Tolerance: 10%; Max Operating Temperature: 85°C; Package Quantity: 1; Width: 0.02inch; Voltage Rating: 10V; Contact Plating: Tin; Height: 0.5mm; Min Operating Temperature: -55°C; Case Code (Metric): 1005; Packaging: Tape and Reel
C102 C103 C108 C109 = CMP-2008-03918-1: Part Number: GRM1555C1H180JA01D; Manufacturer: Murata
R46 R51 = CMP-2002-03043-1: as R27 on sheet USB_HUB
R47-R49 R52-R54 = CMP-2002-07047-1: Manufacturer: Yageo / Phycomp; Part Number: RC0402FR-0749K9L
R50 R55 = CMP-2002-00646-4: Chip Resistor, 12 KOhm, +/- 1%, 0.1 W, -55 to 155 degC, 0402 (1005 Metric), RoHS, Tape and Reel; PartNumber: ERJ-2RKF1202X; Resistance: 12 KOhm; Voltage Rating: 50 V; Case\/Package: 0402; Power Rating: 100 mW; Length: 1 mm; PackageReference: 0402; DatasheetVersion: 04/2015; ComponentLink2Description: Datasheet; ComponentLink1URL: http://www.panasonic.com/; Pins: 2; Width: 0.5 mm; REACH SVHC: Yes; Packaging: Tape and Reel; Min Operating Temperature: -55 degC; Mounting Technology: Surface Mount; Max Operating Temperature: 155 degC; Case Code (Imperial): 0402; Height: 0.35 mm; Tolerance: 1%; PackageDescription: 2-Pin Surface Mount Device, Body 1 x 0.5 mm; RoHSCompliant: true; ComponentLink1Description: Manufacturer URL; Mount: Surface Mount; ComponentLink2URL: http://industrial.panasonic.com/cdbs/www-data/pdf/RDA0000/AOA0000C86.pdf; Package Quantity: 10000; Case Code (Metric): 1005
U18 U19 = CMP-06284-000010-1: IC HUB CTLR USB 2.0 24QFN; Manufacturer: Microchip; Min Supply Voltage: 3V; Standoff Height: 0mm; Usb Standard: USB 2.0; Interface: I2C,USB,SMBus; Number Of Ports: 2; Max Supply Voltage: 3.6V; Nominal Supply Current: 29-70mA; Device Class L1: Integrated Circuits (ICs); ComponentLink2URL: http://ww1.microchip.com/downloads/en/DeviceDoc/00001726B.pdf; Temperature: -40°C to +85°C; Lead Free: Yes; Category: IC; RoHS: TRUE; Digikey Description: IC HUB CTLR USB 2.0 24QFN; Device Class L2: Interface ICs; Height: 1mm; Device Class L3: USB Interface ICs; Temperature Range High: +85°C; Automotive: No; Ipc Land Pattern Name: QFN50P400X400X90-24; Temperature Range Low: -40°C; Manufacturer Part Number: USB2422-I/MJ; Mouser Description: Microchip USB2422-I/MJ; USB Controller; USB 2.0; 3 - 3.6 V; 24-Pin SQFN; Package: 24-S4QFN-4x4B-0.5P; Ambient Temperature Range Low: -40°C; ComponentLink2Description: Datasheet; Ambient Temperature Range High: +85°C; Octopart: https://octopart.com/usb2422-i%2Fmj-microchip-29030614
Y4 Y5 = CMP-27762-003871-2: Crystal 24MHz ±20ppm (Tol) ±30ppm (Stability) 18pF FUND 60Ω 4-Pin SMD T/R; ESR (Equivalent Series Resistance): 60R; Load Capacitance: 18pF; Height: 0.039inch; Operating Frequency: 24 MHz; Tolerance: 20ppm; Packaging: Tape and Reel; Case/Package: CSMD; Mount: Surface Mount; Number of Pins: 4; Length: 3.2mm; Series: ABM8G; Lead Free: Lead Free; Package Quantity: 1000; Series Resistance: 60R; Frequency Tolerance: 20ppm; Min Operating Temperature: -40°C; Termination: SMD/SMT; Radiation Hardening: No; Frequency: 24MHz; Frequency Stability: 30ppm; Depth: 2.5mm; Width: 0.098inch; Max Operating Temperature: 85°C